# EAGLE design CC2530_PCB_Updated_Antenna+Stim+EMG-ROACH (EAGLE 7.1.0)
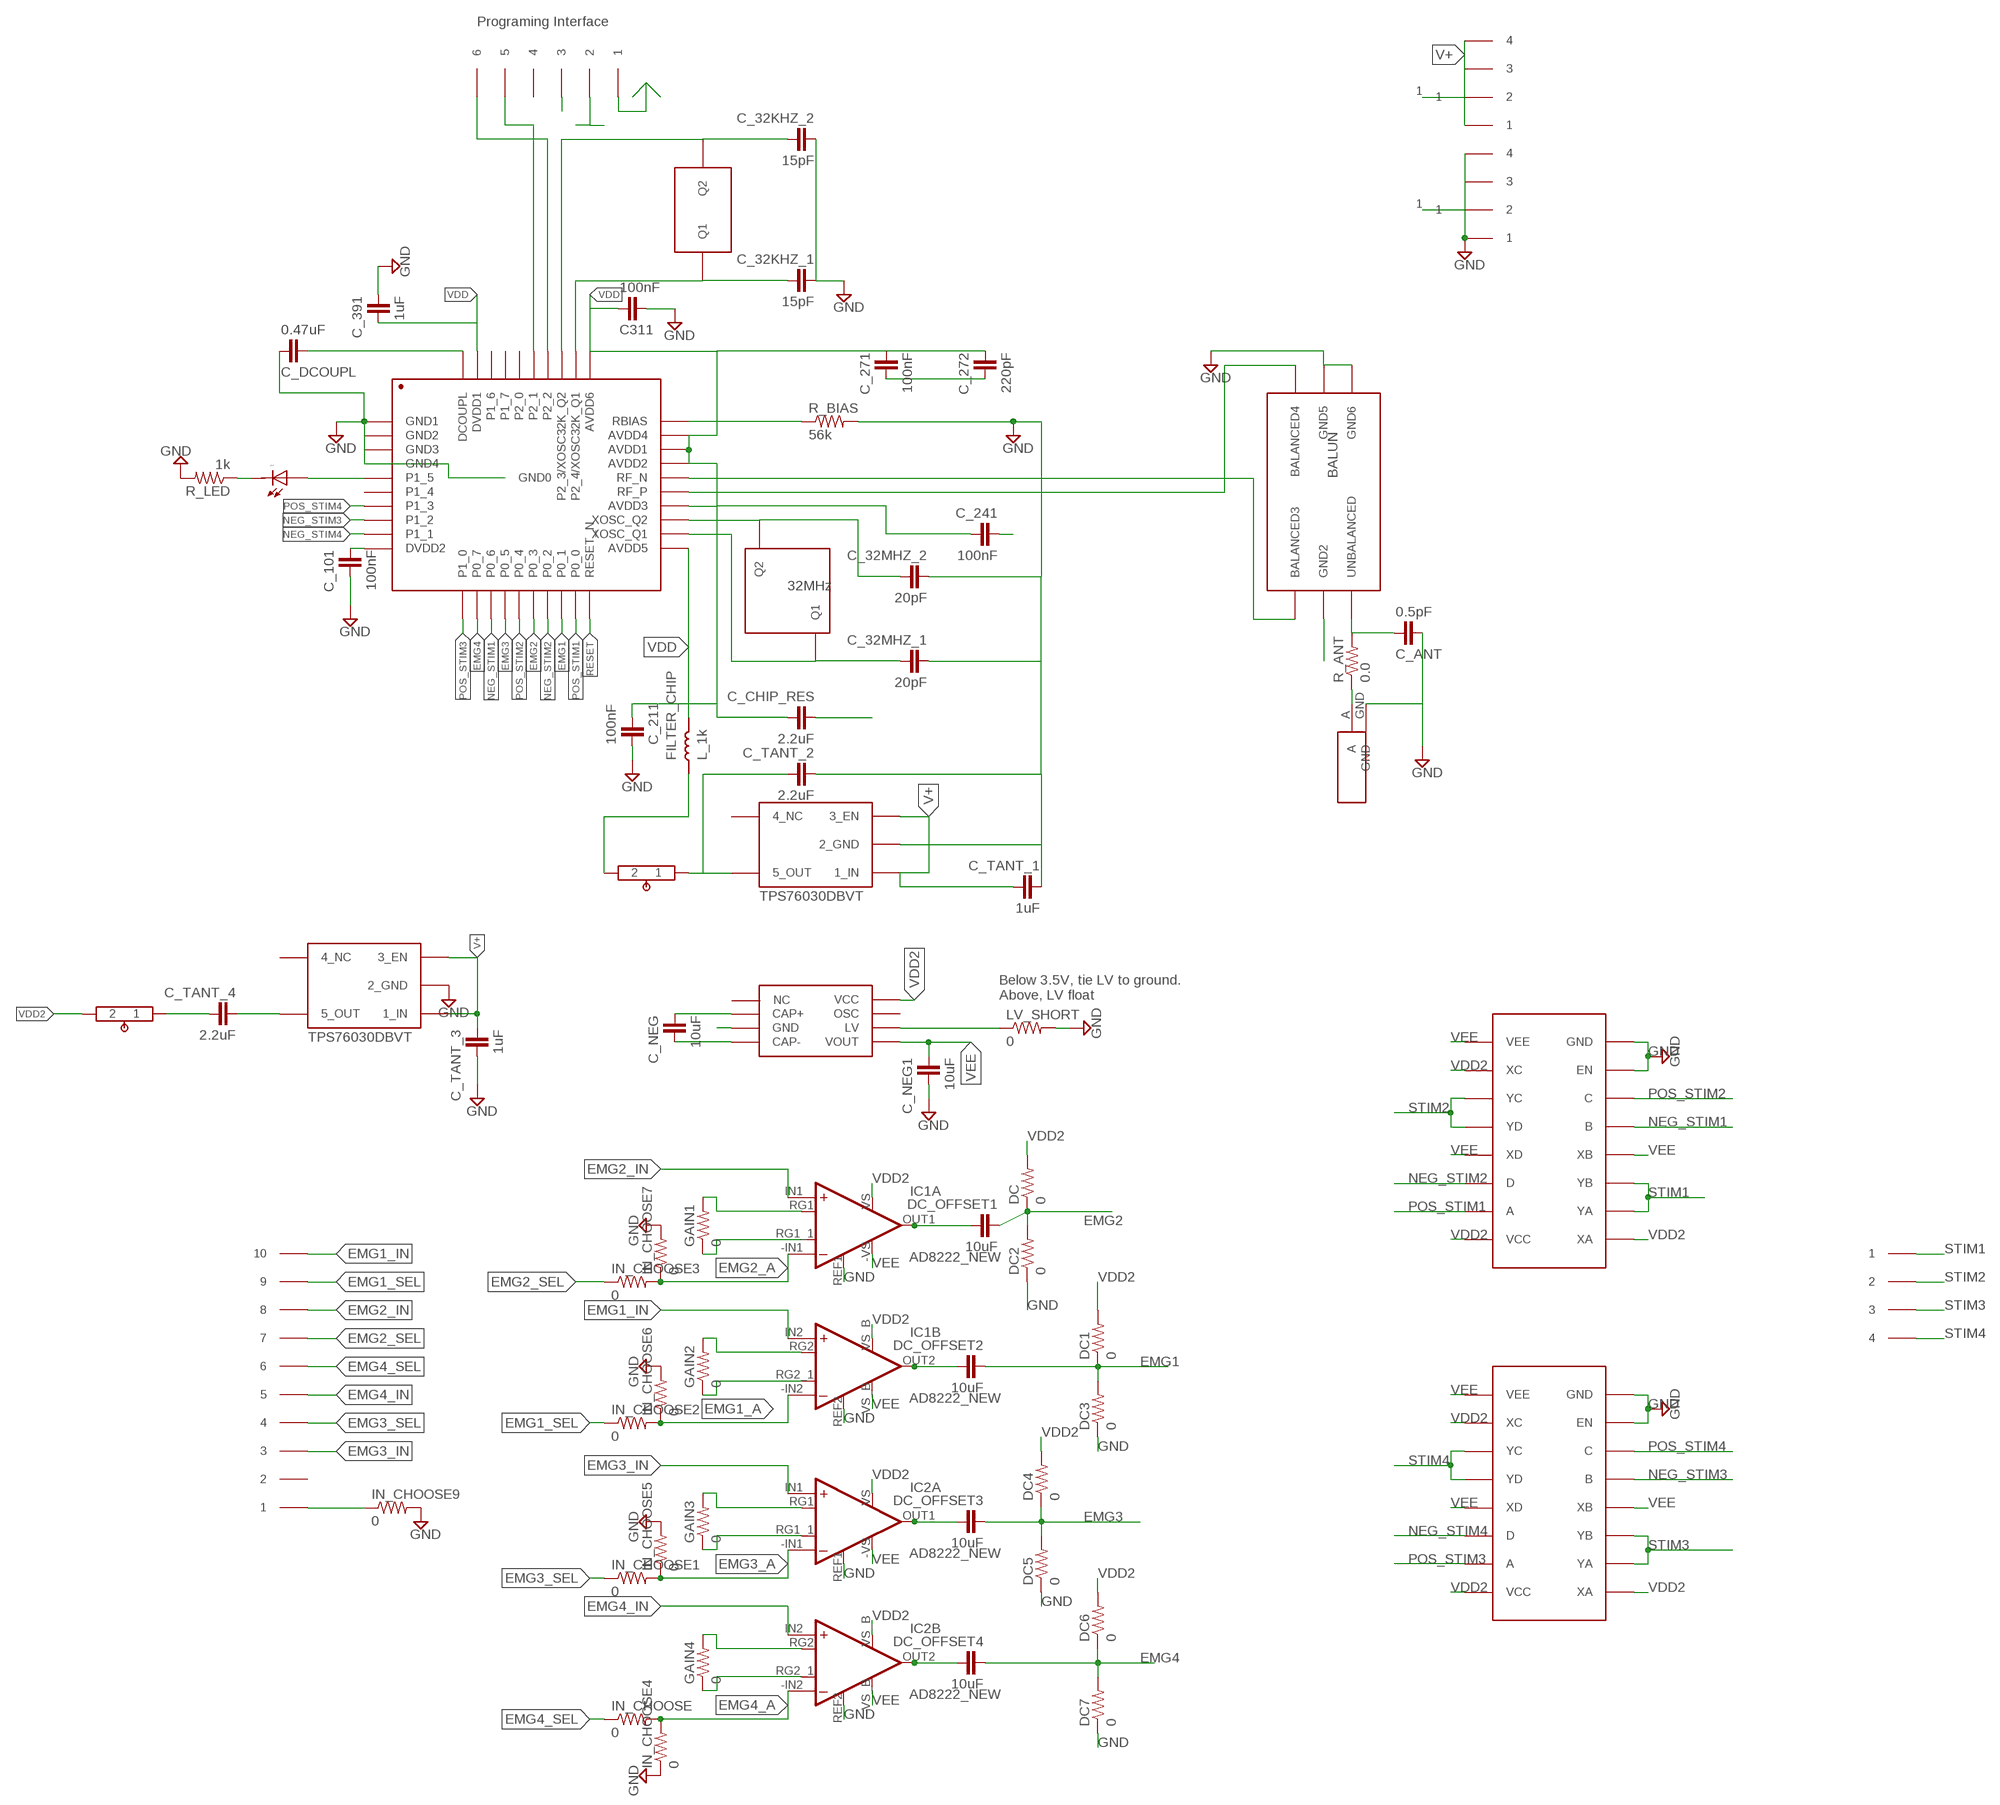
[diagram p0: schematic, sheet 1]

## Parts
32KHZ  X32.768KHZ  [X32.768KHZ]
C311  100nF  0Y0X_C0201  [0201_R/L/C]
C_32KHZ_1  15pF  0Y0X_C0201  [0201_R/L/C]
C_32KHZ_2  15pF  0Y0X_C0201  [0201_R/L/C]
C_32MHZ_1  20pF  0Y0X_C0201  [0201_R/L/C]
C_32MHZ_2  20pF  0Y0X_C0201  [0201_R/L/C]
C_101  100nF  0Y0X_C0201  [0201_R/L/C]
C_211  100nF  0Y0X_C0201  [0201_R/L/C]
C_241  100nF  0Y0X_C0201  [0201_R/L/C]
C_271  100nF  0Y0X_C0201  [0201_R/L/C]
C_272  220pF  0Y0X_C0201  [0201_R/L/C]
C_391  1uF  0Y0X_C0201  [0201_R/L/C]
C_ANT  0.5pF  0Y0X_C0201  [0201_R/L/C]
C_CHIP_RES  2.2uF  0Y0X_C0402  [0402_R/L/C]
C_DCOUPL  0.47uF  0Y0X_C0201  [0201_R/L/C]
C_NEG  10uF  0Y0X_C0402  [0402_R/L/C]
C_NEG1  10uF  0Y0X_C0402  [0402_R/L/C]
C_TANT_1  1uF  0Y0X_C0603  [0603_R/L/C]
C_TANT_2  2.2uF  0Y0X_C0603  [0603_R/L/C]
C_TANT_3  1uF  0Y0X_C0603  [0603_R/L/C]
C_TANT_4  2.2uF  0Y0X_C0603  [0603_R/L/C]
DC  0  0Y0X_R0402  [0402_R/L/C]
DC1  0  0Y0X_R0402  [0402_R/L/C]
DC2  0  0Y0X_R0402  [0402_R/L/C]
DC3  0  0Y0X_R0402  [0402_R/L/C]
DC4  0  0Y0X_R0402  [0402_R/L/C]
DC5  0  0Y0X_R0402  [0402_R/L/C]
DC6  0  0Y0X_R0402  [0402_R/L/C]
DC7  0  0Y0X_R0402  [0402_R/L/C]
DC_OFFSET1  10uF  0Y0X_C0402  [0402_R/L/C]
DC_OFFSET2  10uF  0Y0X_C0402  [0402_R/L/C]
DC_OFFSET3  10uF  0Y0X_C0402  [0402_R/L/C]
DC_OFFSET4  10uF  0Y0X_C0402  [0402_R/L/C]
FILTER_CHIP  L_1k  0Y0X_L0402  [0402_R/L/C]
GAIN1  0  0Y0X_R0402  [0402_R/L/C]
GAIN2  0  0Y0X_R0402  [0402_R/L/C]
GAIN3  0  0Y0X_R0402  [0402_R/L/C]
GAIN4  0  0Y0X_R0402  [0402_R/L/C]
GND_IN  FFC4POS  [FFC4POS]
IC1  AD8222_NEW  [QFN-16]
IC2  AD8222_NEW  [QFN-16]
IN_CHOOSE  0  0Y0X_R0201  [0201_R/L/C]
IN_CHOOSE1  0  0Y0X_R0201  [0201_R/L/C]
IN_CHOOSE2  0  0Y0X_R0201  [0201_R/L/C]
IN_CHOOSE3  0  0Y0X_R0201  [0201_R/L/C]
IN_CHOOSE4  0  0Y0X_R0201  [0201_R/L/C]
IN_CHOOSE5  0  0Y0X_R0201  [0201_R/L/C]
IN_CHOOSE6  0  0Y0X_R0201  [0201_R/L/C]
IN_CHOOSE7  0  0Y0X_R0201  [0201_R/L/C]
IN_CHOOSE9  0  0Y0X_R0201  [0201_R/L/C]
INVERTED_F-ANTENNA  ANTENNA  [ANTENNA]
LED  LED0603  [0603_R/L/C]
LV_SHORT  0  0Y0X_R0402  [0402_R/L/C]
R_ANT  0.0  0Y0X_R0201  [0201_R/L/C]
R_BIAS  56k  0Y0X_R0201  [0201_R/L/C]
R_LED  1k  0Y0X_R0402  [0402_R/L/C]
U$1  CC2530  [CC2530]
U$2  BALUN  [BALUN]
U$3  X32MHZ  [X32MHZ]
U$4  TL7660  [S-PDSO-G8]
U$5  MC74HC4316A  [SOIC-16-ON-SEMI]
U$6  MC74HC4316A  [SOIC-16-ON-SEMI]
U$7  FFC10POS  [FFC10POS]
U$8  REGULATOR  [REGULATOR]
U$9  SWITCH_MANUAL  [SWITCH_MANUAL]
U$10  REGULATOR  [REGULATOR]
U$17  FFC6POS  [FFC6POS]
U$18  SWITCH_MANUAL  [SWITCH_MANUAL]
U$28  FFC4POS  [FFC4POS]
V+_IN  FFC4POS  [FFC4POS]
WIRE+  DRILL_CONNECT  [DRILL_CONNECT]
WIRE-  DRILL_CONNECT  [DRILL_CONNECT]

## Nets
DCOUPL1: C_DCOUPL.1 U$1.DCOUPL
EMG1: DC1.1 DC3.2 DC_OFFSET2.2 U$1.P0_1
EMG1_A: IC1.-IN2(B:-IN) IN_CHOOSE2.2 IN_CHOOSE6.1
EMG1_IN: IC1.IN2(B:+IN) U$7.10
EMG1_SEL: IN_CHOOSE2.1 U$7.9
EMG2: DC2.2 DC.1 DC_OFFSET1.2 U$1.P0_3
EMG2_A: IC1.-IN1(A:-IN) IN_CHOOSE3.2 IN_CHOOSE7.1
EMG2_IN: IC1.IN1(A:+IN) U$7.8
EMG2_SEL: IN_CHOOSE3.1 U$7.7
EMG3: DC4.1 DC5.2 DC_OFFSET3.2 U$1.P0_5
EMG3_A: IC2.-IN1(A:-IN) IN_CHOOSE1.2 IN_CHOOSE5.1
EMG3_IN: IC2.IN1(A:+IN) U$7.3
EMG3_SEL: IN_CHOOSE1.1 U$7.4
EMG4: DC6.1 DC7.2 DC_OFFSET4.2 U$1.P0_7
EMG4_A: IC2.-IN2(B:-IN) IN_CHOOSE4.2 IN_CHOOSE.2
EMG4_IN: IC2.IN2(B:+IN) U$7.5
EMG4_SEL: IN_CHOOSE.1 U$7.6
GND: C311.1 C_32KHZ_1.2 C_32KHZ_2.2 C_32MHZ_1.2 C_32MHZ_2.2 C_101.1 C_211.2 C_241.2 C_271.1 C_272.1 C_391.2 C_ANT.1 C_CHIP_RES.2 C_DCOUPL.2 C_NEG1.1 C_TANT_1.2 C_TANT_2.2 C_TANT_3.1 DC2.1 DC3.1 DC5.1 DC7.1 GND_IN.1 GND_IN.2 GND_IN.3 GND_IN.4 IC1.REF1(A:REF) IC1.REF2(B:REF) IC2.REF1(A:REF) IC2.REF2(B:REF) IN_CHOOSE4.1 IN_CHOOSE5.2 IN_CHOOSE6.2 IN_CHOOSE7.2 IN_CHOOSE9.2 INVERTED_F-ANTENNA.GND LV_SHORT.2 R_BIAS.2 R_LED.2 U$1.GND0 U$1.GND1 U$1.GND001(GND0) U$1.GND2 U$1.GND002(GND0) U$1.GND3 U$1.GND003(GND0) U$1.GND4 U$1.GND004(GND0) U$1.GND005(GND0) U$1.GND006(GND0) U$1.GND007(GND0) U$1.GND008(GND0) U$1.GND009(GND0) U$1.GND010(GND0) U$1.GND011(GND0) U$1.GND012(GND0) U$1.GND013(GND0) U$1.GND014(GND0) U$1.GND015(GND0) U$1.GND016(GND0) U$2.GND2 U$2.GND5 U$2.GND6 U$4.3(GND) U$5.7(EN) U$5.8(GND) U$6.7(EN) U$6.8(GND) U$8.2(2_GND) U$10.2(2_GND) U$17.2 WIRE-.1
LED/P1_5: LED.1(A) U$1.P1_5
N$1: C_ANT.2 R_ANT.2 U$2.UNBALANCED
N$2: INVERTED_F-ANTENNA.A R_ANT.1
N$3: C_NEG.2 U$4.2(CAP+)
N$4: C_NEG.1 U$4.4(CAP-)
N$5: LV_SHORT.1 U$4.6(LV)
N$6: GAIN1.2 IC1.RG1(A:RG1)
N$7: GAIN1.1 IC1.RG1_1(A:RG1_1)
N$8: GAIN2.2 IC1.RG2(B:RG1)
N$9: GAIN2.1 IC1.RG2_1(B:RG1_1)
N$10: GAIN3.2 IC2.RG1(A:RG1)
N$11: GAIN3.1 IC2.RG1_1(A:RG1_1)
N$12: GAIN4.2 IC2.RG2(B:RG1)
N$13: GAIN4.1 IC2.RG2_1(B:RG1_1)
N$14: DC_OFFSET1.1 IC1.OUT1(A:OUT)
N$15: DC_OFFSET2.1 IC1.OUT2(B:OUT)
N$16: DC_OFFSET4.1 IC2.OUT2(B:OUT)
N$17: DC_OFFSET3.1 IC2.OUT1(A:OUT)
N$18: C_TANT_4.2 U$8.5(5_OUT)
N$19: C_TANT_4.1 U$9.1
N$21: C_TANT_2.1 U$10.5(5_OUT) U$18.1
N$28: IN_CHOOSE9.1 U$7.1
N$34: LED.2(C) R_LED.1
NEG_STIM1: U$1.P0_6 U$5.5(B)
NEG_STIM2: U$1.P0_2 U$5.14(D)
NEG_STIM3: U$1.P1_2 U$6.5(B)
NEG_STIM4: U$1.P1_1 U$6.14(D)
P2_1: U$1.P2_1 U$17.5
P2_2: U$1.P2_2 U$17.6
P2_3/X32K_Q2: 32KHZ.Q2 C_32KHZ_2.1 U$1.P2_3/XOSC32K_Q2
P2_4/X32K_Q1: 32KHZ.Q1 C_32KHZ_1.1 U$1.P2_4/XOSC32K_Q1
POS_STIM1: U$1.P0_0 U$5.15(A)
POS_STIM2: U$1.P0_4 U$5.6(C)
POS_STIM3: U$1.P1_0 U$6.15(A)
POS_STIM4: U$1.P1_3 U$6.6(C)
RBIAS: R_BIAS.1 U$1.RBIAS
RESET: U$1.RESET_N U$17.3
RF_N: U$1.RF_N U$2.BALANCED3
RF_P: U$1.RF_P U$2.BALANCED4
STIM1: U$5.2(YA) U$5.3(YB) U$28.1
STIM2: U$5.11(YC) U$5.12(YD) U$28.2
STIM3: U$6.2(YA) U$6.3(YB) U$28.3
STIM4: U$6.11(YC) U$6.12(YD) U$28.4
SWITCH_OUT: FILTER_CHIP.1 U$18.2
V+: C_TANT_1.1 C_TANT_3.2 U$8.1(1_IN) U$8.3(3_EN) U$10.1(1_IN) U$10.3(3_EN) V+_IN.1 V+_IN.2 V+_IN.3 V+_IN.4 WIRE+.1
VDD: C311.2 C_101.2 C_211.1 C_241.1 C_271.2 C_272.2 C_391.1 C_CHIP_RES.1 FILTER_CHIP.2 U$1.AVDD1 U$1.AVDD2 U$1.AVDD3 U$1.AVDD4 U$1.AVDD5 U$1.AVDD6 U$1.DVDD1 U$1.DVDD2 U$17.1
VDD2: DC1.2 DC4.2 DC6.2 DC.2 IC1.VS(A:V+) IC1.VS_B(B:V+) IC2.VS(A:V+) IC2.VS_B(B:V+) U$4.8(VCC) U$5.1(XA) U$5.10(XC) U$5.16(VCC) U$6.1(XA) U$6.10(XC) U$6.16(VCC) U$9.2
VEE: C_NEG1.2 IC1.-VS(A:V-) IC1.-VS_B(B:V-) IC2.-VS(A:V-) IC2.-VS_B(B:V-) U$4.5(VOUT) U$5.4(XB) U$5.9(VEE) U$5.13(XD) U$6.4(XB) U$6.9(VEE) U$6.13(XD)
X32M_Q1: C_32MHZ_1.1 U$1.XOSC_Q1 U$3.Q1
X32M_Q2: C_32MHZ_2.1 U$1.XOSC_Q2 U$3.Q2
Unconnected: U$1.P1_4 U$1.P1_6 U$1.P1_7 U$1.P2_0 U$7.2 U$8.4(4_NC) U$10.4(4_NC) U$17.4

## Notes on the sheet
- Programing Interface
- Below 3.5V, tie LV to ground. 
  Above, LV float

## Power pins joined to a net without a drawn wire
NC: U$4.1(NC)
OSC: U$4.7(OSC)

## Library data of the parts
32KHZ = CC2530_PCB_TL:X32.768KHZ: X32.768kHz 9HT11-32.768KDZC-T
C311 C_32KHZ_1 C_32KHZ_2 C_32MHZ_1 C_32MHZ_2 C_101 C_211 C_241 C_271 C_272 C_391 C_ANT C_CHIP_RES C_DCOUPL C_NEG C_NEG1 C_TANT_1-C_TANT_4 DC_OFFSET1-DC_OFFSET4 = CC2530_PCB_TL:0Y0X_C
DC DC1-DC7 GAIN1-GAIN4 IN_CHOOSE IN_CHOOSE1-IN_CHOOSE7 IN_CHOOSE9 LV_SHORT R_ANT R_BIAS R_LED = CC2530_PCB_TL:0Y0X_R: Package / Case 0201 (0603 Metric)
FILTER_CHIP = CC2530_PCB_TL:0Y0X_L
GND_IN U$28 V+_IN = CC2530_PCB_TL:FFC4POS: FFC COnnector 4POS
IC1 IC2 = moth:AD8222_NEW: OP AMP AD8222 Dual package instrumentation amplifier
INVERTED_F-ANTENNA = CC2530_PCB_TL:ANTENNA: Antenna
LED = CC2530_PCB_TL:LED
U$1 = CC2530_PCB_TL:CC2530: CC2530_QFN40
U$2 = CC2530_PCB_TL:BALUN: 2.45 GHz Impedance Matched Balun-BPF: For TI CC253X, CC254X, CC257X, CC853X and CC852X Chipset family P/N 2450BM15A0002
U$3 = CC2530_PCB_TL:X32MHZ: X32MHz ABM12-32.000MHZ-B2X-T3; X: 32MHz
U$4 = moth:TL7660
U$5 U$6 = moth:MC74HC4316A
U$7 = CC2530_PCB_TL:FFC10POS: FFC Connector 10POS
U$8 U$10 = CC2530_PCB_TL:REGULATOR: IC REG LDO 3V 50MA SOT23-5 TPS76030DBVT
U$9 U$18 = CC2530_PCB_TL:SWITCH_MANUAL
U$17 = CC2530_PCB_TL:FFC6POS: FFC Connector 6POS
WIRE+ WIRE- = CC2530_PCB_TL:DRILL_CONNECT

## Board
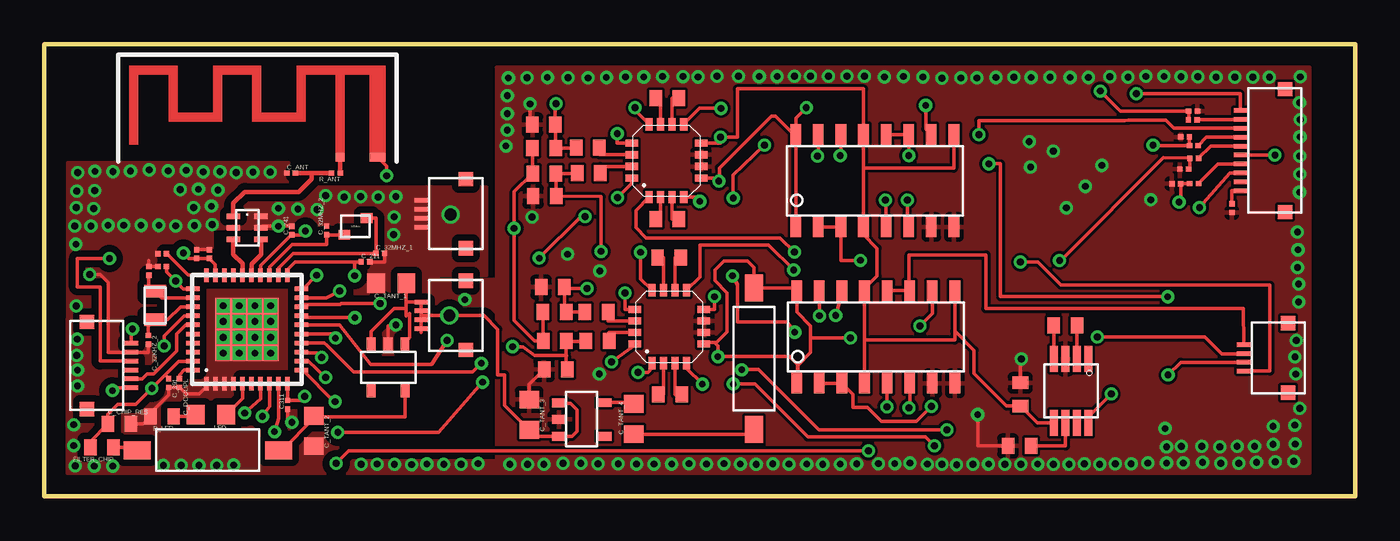
[diagram p1: board, top side]
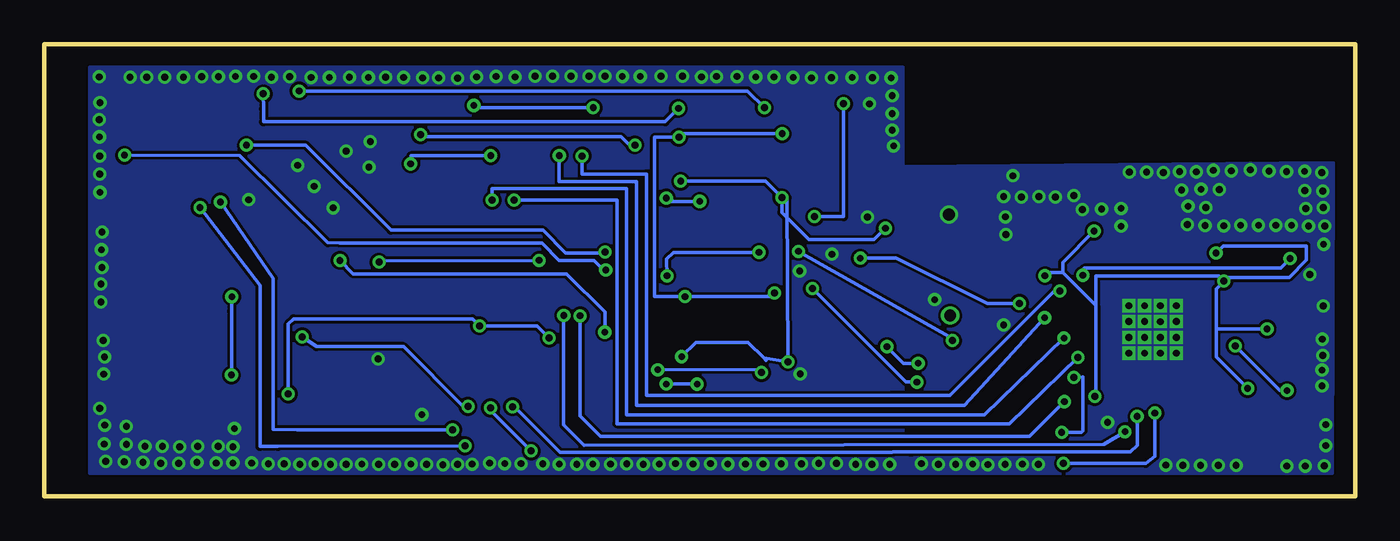
[diagram p2: board, bottom side, seen from below]

Size 73.66 x 25.4 mm. Coordinates in mm from the lower left corner, seen from the top.
Outline: 0,0 0,25.4 73.66,25.4 73.66,0 0,0
Copper layers (1*16): Top 0.0356mm / dielectric 1.5011mm / Bottom 0.0356mm
Design rules "Eagle_DRC_OSHPark": minimum track width 6mil, minimum drill 13mil, track to track 6mil, track to pad 6mil, pad to pad 6mil, via to via 6mil, smd to smd 6mil, copper to edge 15mil, drill to drill 6mil, minimum pad ring 7mil, minimum via ring 7mil, stop-mask expansion 3mil, vias tented up to drill 0mil, thermal gap 10mil

### Footprints (pad centres in the part's own frame; a part is rotated, then mirrored left to right if it is on the bottom)
X32.768KHZ = smd 1.25 x 0.7: Q1 0.009,-0.811; Q2 0.009,0.789
0201_R/L/C = smd 0.3 x 0.3: 1 -0.245,-0.001; 2 0.245,-0.001
0402_R/L/C = smd 0.7 x 0.9: 1 -0.65,0.001; 2 0.65,0.001
0603_R/L/C = smd 1 x 1.1: 1 -0.85,0; 2 0.85,0
FFC4POS = smd 0.762 x 0.254: 1 0.04,0.742; 2 0.04,0.242; 3 0.04,-0.258; 4 0.04,-0.758 | smd 0.8 x 0.8: P$5 -2.46,1.94; P$6 -2.46,-1.96
QFN-16 = smd 0.7 x 0.4: -IN1 -2.05,0.975; -IN2 2.05,0.975; IN1 -2.05,-0.975; IN2 2.05,-0.975; RG1 -2.05,0.325; RG1_1 -2.05,-0.325; RG2 2.05,0.325; RG2_1 2.05,-0.325 | smd 0.4 x 0.7: -VS 0.975,1.95; -VS_B 0.975,-1.95; OUT1 -0.325,1.95; OUT2 0.325,1.95; REF1 -0.325,-1.95; REF2 0.325,-1.95; VS -0.975,1.95; VS_B -0.975,-1.95
ANTENNA = smd 0.5 x 0.5: A 0,0 | smd 0.5 x 0.9: GND 0,-2.1
CC2530 = smd 0.762 x 0.254: AVDD1 3.048,1.27; AVDD2 3.048,0.762; AVDD3 3.048,-0.762; AVDD4 3.048,1.778; AVDD5 3.048,-2.286; DVDD2 -3.048,-2.286; GND1 -3.048,2.286; GND2 -3.048,1.778; GND3 -3.048,1.27; GND4 -3.048,0.762; P1_1 -3.048,-1.778; P1_2 -3.048,-1.27; P1_3 -3.048,-0.762; P1_4 -3.048,-0.254; P1_5 -3.048,0.254; RBIAS 3.048,2.286; RF_N 3.048,0.254; RF_P 3.048,-0.254; XOSC_Q1 3.048,-1.778; XOSC_Q2 3.048,-1.27 | smd 0.254 x 0.762: AVDD6 2.286,3.048; DCOUPL -2.286,3.048; DVDD1 -1.778,3.048; P0_0 1.778,-3.048; P0_1 1.27,-3.048; P0_2 0.762,-3.048; P0_3 0.254,-3.048; P0_4 -0.254,-3.048; P0_5 -0.762,-3.048; P0_6 -1.27,-3.048; P0_7 -1.778,-3.048; P1_0 -2.286,-3.048; P1_6 -1.27,3.048; P1_7 -0.762,3.048; P2_0 -0.254,3.048; P2_1 0.254,3.048; P2_2 0.762,3.048; P2_3/XOSC32K_Q2 1.27,3.048; P2_4/XOSC32K_Q1 1.778,3.048; RESET_N 2.286,-3.048 | smd 3.56 x 3.56: GND0 0,0 | drill 0.381 square: GND001 -1.335,1.335; GND002 -0.445,1.335; GND003 0.445,1.335; GND004 1.335,1.335; GND005 -1.335,0.445; GND006 -0.445,0.445; GND007 0.44,0.445; GND008 1.335,0.445; GND009 -1.335,-0.445; GND010 -0.445,-0.445; GND011 0.445,-0.445; GND012 1.335,-0.445; GND013 -1.335,-1.335; GND014 -0.445,-1.335; GND015 0.445,-1.335; GND016 1.335,-1.335
BALUN = smd 0.75 x 0.3: BALANCED3 -0.782,-0.655; BALANCED4 0.768,-0.655; GND2 -0.782,-0.005; GND5 0.768,-0.005; GND6 0.768,0.645; UNBALANCED -0.782,0.645
X32MHZ = smd 0.55 x 0.65: Q1 0.496,-0.576; Q2 -0.454,0.674
S-PDSO-G8 = smd 0.45 x 1.45: 1 -0.975,-1.8; 2 -0.325,-1.8; 3 0.325,-1.8; 4 0.975,-1.8; 5 0.975,1.8; 6 0.325,1.8; 7 -0.325,1.8; 8 -0.975,1.8
SOIC-16-ON-SEMI = smd 0.6 x 1.15: 1 -4.445,-2.6; 2 -3.175,-2.6; 3 -1.905,-2.6; 4 -0.635,-2.6; 5 0.635,-2.6; 6 1.905,-2.6; 7 3.175,-2.6; 8 4.445,-2.6; 9 4.445,2.6; 10 3.175,2.6; 11 1.905,2.6; 12 0.635,2.6; 13 -0.635,2.6; 14 -1.905,2.6; 15 -3.175,2.6; 16 -4.445,2.6
FFC10POS = smd 0.762 x 0.254: 1 -0.015,2.271; 2 -0.015,1.771; 3 -0.015,1.271; 4 -0.015,0.771; 5 -0.015,0.271; 6 -0.015,-0.229; 7 -0.015,-0.729; 8 -0.015,-1.229; 9 -0.015,-1.729; 10 -0.015,-2.229 | smd 0.8 x 0.8: P$11 -2.52,3.47; P$12 -2.52,-3.43
REGULATOR = smd 0.5 x 0.8: 1 0.94,1.275; 2 0,1.275; 3 -0.95,1.275; 4 -0.95,-1.275; 5 0.95,-1.275
SWITCH_MANUAL = smd 1.524 x 1.016: 1 -4.13,0; 2 3.81,0
FFC6POS = smd 0.762 x 0.254: 1 0.008,1.269; 2 0.008,0.769; 3 0.008,0.269; 4 0.008,-0.231; 5 0.008,-0.731; 6 0.008,-1.231 | smd 0.8 x 0.8: P$7 -2.49,2.47; P$8 -2.49,-2.43
DRILL_CONNECT = drill 0.66 pad 1.016: 1 0,0

### Placement (x,y rotation side)
32KHZ  6.23,10.71 180 top
C311  13.67,5.14 90 top
C_32KHZ_1  5.86,12.67 90 top
C_32KHZ_2  5.84,8.79 270 top
C_32MHZ_1  18.87,13.65 0 top
C_32MHZ_2  15.85,14.94 90 top
C_101  6.62,12.91 0 top
C_211  18.04,13.17 0 top
C_241  13.9,14.93 90 top
C_271  9.27,13.62 270 top
C_272  8.56,13.62 270 top
C_391  6.98,6.35 270 top
C_ANT  13.86,18.16 0 top
C_CHIP_RES  4.21,4.06 0 top
C_DCOUPL  7.6,6.35 270 top
C_NEG  57.38,9.58 0 top
C_NEG1  54.84,5.72 270 top
C_TANT_1  19.49,11.98 180 top
C_TANT_2  15.14,3.66 270 top
C_TANT_3  27.25,4.58 270 top
C_TANT_4  33.13,4.34 90 top
DC  28.08,18.15 180 top
DC1  28.08,19.56 180 top
DC2  28.11,16.86 0 top
DC3  28.07,20.89 0 top
DC4  28.67,8.71 180 top
DC5  28.74,7.12 0 top
DC6  28.67,10.35 180 top
DC7  28.57,11.75 0 top
DC_OFFSET1  30.59,18.16 180 top
DC_OFFSET2  30.54,19.6 180 top
DC_OFFSET3  31.08,8.74 180 top
DC_OFFSET4  31.03,10.35 180 top
FILTER_CHIP  3.24,2.75 180 top
GAIN1  35.01,15.59 180 top
GAIN2  35.01,22.39 180 top
GAIN3  35.16,5.71 180 top
GAIN4  35.11,13.41 180 top
GND_IN  21.22,15.87 180 top
IC1  34.96,18.87 90 top
IC2  35.12,9.53 90 top
IN_CHOOSE  64.62,19 180 top
IN_CHOOSE1  64.62,17.58 180 top
IN_CHOOSE2  64.54,21.16 180 top
IN_CHOOSE3  64.6,19.71 180 top
IN_CHOOSE4  64.06,18.39 0 top
IN_CHOOSE5  63.61,17.57 180 top
IN_CHOOSE6  64.56,21.65 0 top
IN_CHOOSE7  64.1,20.2 180 top
IN_CHOOSE9  66.74,16.19 270 top
INVERTED_F-ANTENNA  16.62,19.05 90 top
LED  9.35,4.57 180 top
LV_SHORT  54.81,2.83 180 top
R_ANT  16.38,18.16 180 top
R_BIAS  6.62,13.64 180 top
R_LED  6.61,4.49 180 top
U$1  11.38,9.37 90 top
U$2  11.4,15.09 0 top
U$3  17.53,15.15 90 top
U$4  57.71,5.92 180 top
U$5  46.67,17.74 0 top
U$6  46.73,8.95 0 top
U$7  67.2,19.45 180 top
U$8  30.19,4.31 90 top
U$9  39.87,7.88 90 top
U$10  19.31,7.24 0 top
U$17  4.87,7.33 0 top
U$18  9.02,2.59 180 top
U$28  67.44,7.76 180 top
V+_IN  21.22,10.16 180 top
WIRE+  22.75,10.16 90 top
WIRE-  22.83,15.84 90 top

### Tracks (layer width: path | path; a pad name or v marks a point on that pad's centre or on a via)
DCOUPL1
  Top 0.203: U$1.DCOUPL 7.86,7.09 7.59,6.82 C_DCOUPL.1
EMG1  (via drill 0.38)
  Top 0.203: 18.75,10.65 v18.86,10.84 16.68,10.84 16.62,10.77 14.55,10.77 U$1.P0_1 | DC_OFFSET2.2 29.84,19.56 DC1.1 DC3.2 28.7,20.91 28.7,22.07 v28.75,22.07 | v30.38,15.72 30.15,15.72 v27.81,13.38
  Bottom 0.203: v18.86,10.84 20.68,10.83 25.79,13.38 v27.81,13.38 | v28.75,22.07 28.75,15.72 v30.38,15.72
EMG1_A  (via drill 0.38)
  Top 0.203: IN_CHOOSE2.2 64.31,21.18 IN_CHOOSE6.1 60.48,21.65 v59.35,22.78 | IC1.-IN2 33.2,21.7 v33.2,21.84
  Bottom 0.203: v33.2,21.84 34.14,22.78 v59.35,22.78
EMG1_IN  (via drill 0.38)
  Top 0.203: IC1.IN2 36.82,21.81 v38.03,21.81 | U$7.10 67.2,22.63 v61.36,22.63
  Bottom 0.203: v38.03,21.81 38.78,21.05 61.34,21.05 61.34,21.77 v61.36,22.63
EMG1_SEL
  Top 0.203: U$7.9 67.2,21.16 IN_CHOOSE2.1
EMG2  (via drill 0.38)
  Top 0.203: U$1.P0_3 16.58,9.63 18.34,7.41 21.75,7.41 v22.63,8.75 | v31.28,13.76 31.28,16.84 DC2.2 28.76,18.12 DC.1 29.93,18.15 DC_OFFSET1.2
  Bottom 0.203: v22.63,8.75 22.63,8.85 v31.28,13.76
EMG2_A  (via drill 0.38)
  Top 0.203: IC1.-IN1 33.24,16.07 33.24,15.11 33.82,14.52 41.35,14.52 v42.15,13.72 | IN_CHOOSE7.1 64.36,20.28 IN_CHOOSE3.2 62.33,19.71 v62.31,19.74
  Bottom 0.203: v42.15,13.72 42.19,13.68 44.37,13.68 45.64,14.96 54.19,14.96 58.97,19.74 v62.31,19.74
EMG2_IN  (via drill 0.38)
  Top 0.203: U$7.8 63.48,20.69 63.02,21.14 60.91,21.14 60.74,21.12 52.52,21.13 v52.52,20.32 | v40.47,19.74 38.71,18.06 v38.71,16.76 | v36.83,16.58 36.59,16.82 IC1.IN1
  Bottom 0.203: v52.52,20.32 52.41,20.22 41.26,20.22 40.78,19.74 v40.47,19.74 | v38.71,16.76 38.58,16.58 v36.83,16.58
EMG2_SEL
  Top 0.203: IN_CHOOSE3.1 65.31,20.18 U$7.7
EMG3  (via drill 0.38)
  Top 0.203: DC_OFFSET3.2 30.43,8.69 29.43,8.69 29.43,8.71 DC4.1 29.32,7.74 | DC5.2 29.32,7.12 29.32,7.74 | U$1.P0_5 15.73,8.61 15.88,8.46 17.36,6.98 24.06,6.98 v24.55,7.47 | v26.31,8.4 26.89,8.4 27.56,7.91 29.33,7.91 29.32,7.74
  Bottom 0.203: v24.55,7.47 25.38,7.47 v26.31,8.4
EMG3_A  (via drill 0.38)
  Top 0.203: IN_CHOOSE1.2 IN_CHOOSE5.1 63.88,16.54 v63.77,16.54 | IC2.-IN1 34.14,7.2 33.91,6.97 v33.36,6.96 | v50.72,3.73 43.52,3.73 40.12,7.13 39.22,7.13 v39.19,7.11
  Bottom 0.203: v33.36,6.96 33.55,7.12 v39.19,7.11 | v50.72,3.73 59.46,3.73 60.8,3.75 60.8,12.24 v63.77,16.54
EMG3_IN  (via drill 0.38)
  Top 0.203: IC2.IN1 36.09,7.18 v36.98,6.3 | v64.92,16.23 66.63,18.18 U$7.3 | v38.71,6.3 39.93,6.3 42.91,3.32 49.53,3.32 v50.02,2.83
  Bottom 0.203: v36.98,6.3 38.96,6.3 v38.71,6.3 | v50.02,2.83 60.55,2.79 61.54,2.79 61.54,11.85 v64.92,16.23
EMG3_SEL
  Top 0.203: IN_CHOOSE1.1 65.96,18.68 U$7.4
EMG4  (via drill 0.38)
  Top 0.203: DC_OFFSET4.2 DC6.1 29.22,10.35 DC7.2 29.3,11.67 v30.5,11.67 | U$1.P0_7 14.83,7.59 v15.8,6.68 | v16.49,3.59 22.15,3.59 v24.63,6.41
  Bottom 0.203: v15.8,6.68 15.29,6.7 15.29,3.67 15.38,3.59 v16.49,3.59 | v24.63,6.41 25.25,6.42 v30.5,11.67
EMG4_A  (via drill 0.38)
  Top 0.203: IN_CHOOSE4.2 64.37,18.38 IN_CHOOSE.2 62.89,19.02 57.14,13.28 v57.05,13.25 | v42.17,9.22 41.76,9.79 38.94,9.79 38.94,11.89 v38.68,12.39 | IC2.-IN2 33.5,12.22 v33.5,13.71
  Bottom 0.203: v33.5,13.71 38.3,13.71 38.69,13.33 v38.68,12.39 | v57.05,13.25 56.3,12.5 44.33,12.5 42.17,10.34 v42.17,9.22
EMG4_IN  (via drill 0.38)
  Top 0.203: v69.16,19.17 v69.16,19.18 U$7.5 | v42.11,12.71 40.7,14.13 36.84,14.13 36.84,12.34 IC2.IN2
  Bottom 0.203: v42.11,12.71 42.2,12.8 42.33,12.8 42.78,13.26 44.72,13.26 45.71,14.24 57.08,14.24 57.74,14.26 62.7,19.16 v69.16,19.17
EMG4_SEL
  Top 0.203: U$7.6 65.54,19.68 IN_CHOOSE.1
GND  (via drill 0.38, 0.38 pad 0.64)
  Top 0.203: U$1.GND4 U$1.GND3 U$1.GND2 U$1.GND1 9.1,6.14 8.71,5.75 7.95,5.75 C_DCOUPL.2 C_391.2 6.98,5.7 5.96,4.68 R_LED.2 5.54,4.06 C_CHIP_RES.2 | C_32KHZ_2.2 5.84,8.09 U$17.2 3.58,8.09 3.58,12.02 3.14,12.46 v2.54,12.46 | C_32KHZ_1.2 5.86,13.26 | C_32KHZ_1.2 | C_32KHZ_1.2 C_101.1 | C_272.1 C_271.1 | 12.14,8.04 U$1.GND009 U$1.GND005 U$1.GND001 U$1.GND002 U$1.GND006 U$1.GND010 U$1.GND011 U$1.GND007 U$1.GND003 U$1.GND004 U$1.GND008 U$1.GND012 U$1.GND016 U$1.GND015 U$1.GND014 U$1.GND013 | C_241.2 12.26,15.18 U$2.GND5 | INVERTED_F-ANTENNA.GND 19.23,18.55 v19.23,18.02 | C311.1 13.67,4.38 v13.9,4.14 | 18.62,11.98 C_TANT_1.2 | 18.62,13.17 C_211.2 19.12,13.17 C_32MHZ_1.2 | DC3.1 27.3,20.89 v27.3,22.06 | LV_SHORT.2 52.45,2.83 v52.45,4.58 | v54.91,7.71 54.84,7.71 C_NEG1.1 | U$10.2 19.31,9.56 v19.75,9.62 | C_TANT_3.1 27.25,6.28 DC5.1
  other vias: 1.81,17.15 7.96,18.32 3.85,18.24 4.83,18.28 1.86,18.2 9.86,18.24 6.96,18.29 12.68,18.23 6.68,1.73 7.68,1.73 9.68,1.72 8.68,1.72 13.15,15.18 13.15,16.18 14.24,16.14 15.33,16.11 8.92,18.23 2.83,18.27 19.62,14.71 10.64,1.75 23.63,11.05 29.4,13.6 31.21,12.67 1.73,1.71 2.79,1.69 3.84,1.69 1.64,2.84 1.64,4.02 1.84,8.83 5.88,18.35 1.79,16.23 2.82,17.18 7.63,17.24 9.75,17.21 8.43,15.22 3.57,15.23 8.65,17.26 9.38,16.3 10.77,18.19 9.42,15.27 2.61,15.19 11.71,18.23 1.82,7.92 1.86,7.09 26.07,23.52 27.12,23.54 29.43,23.54 28.27,23.55 30.55,23.52 67.12,1.84 66.11,1.85 70.23,1.96 62.99,3.8 27.41,15.7 50.44,23.5 31.18,6.87 69.18,1.93 70.43,12.86 68.12,1.9 7.37,15.2 6.43,15.23 5.43,15.23 4.46,15.23 8.38,16.23 1.7,15.19 2.77,16.17 19.64,15.7 19.75,16.84 18.76,16.82 17.77,16.84 16.84,16.82 15.81,16.91 70.3,2.93 70.27,3.99 65.09,1.9 64.01,1.86 63.07,1.86 62.02,1.86 62.18,16.67 63.07,2.77 63.9,2.8 65.05,2.8 66.06,2.76 67.04,2.8 68.01,2.8 69.06,2.91 69.06,3.92 70.49,11.92 70.46,13.86 70.49,10.91 70.28,7.83 70.59,21.17 70.57,20.2 70.55,19.13 70.55,18.12 55.42,18.5 55.35,19.93 57.43,16.22 58.51,17.42 59.44,18.6 56.7,19.41 31.58,23.55 32.66,23.57 33.68,23.57 34.73,23.6 35.89,23.6 36.74,23.57 26.02,22.51 26.02,21.51 26.02,20.58 37.8,23.62 39.01,23.62 40.18,23.6 41.18,23.6 42.16,23.62 43.06,23.62 44.06,23.62 45.1,23.62 46.08,23.62 47.21,23.58 48.28,23.6 49.38,23.58 51.51,23.52 52.41,23.52 53.47,23.54 54.49,23.56 55.45,23.54 56.52,23.56 57.65,23.54 58.67,23.54 59.88,23.58 60.9,23.56 61.9,23.61 62.92,23.61 63.88,23.58 64.82,23.58 65.85,23.56 66.91,23.56 67.91,23.56 68.85,23.56 70.59,23.58 70.54,22.12 70.54,17.08 70.42,14.86 70.56,4.93 61.08,1.82 60.18,1.82 40.94,1.81 41.85,1.8 42.84,1.8 43.74,1.79 44.73,1.8 45.65,1.81 46.88,1.82 47.79,1.82 48.65,1.86 49.62,1.8 50.45,1.79 51.26,1.76 52.19,1.78 53.06,1.8 53.98,1.79 54.88,1.79 55.83,1.8 56.71,1.79 57.59,1.79 58.44,1.82 59.31,1.79 40,1.79 39.11,1.8 38.2,1.82 37.21,1.8 36.23,1.83 35.25,1.8 34.26,1.8 33.27,1.8 32.25,1.82 31.12,1.82 30.15,1.84 29.14,1.84 28.07,1.79 27.15,1.78 26.16,1.78 24.38,1.83 23.41,1.78 22.44,1.78 21.49,1.8 20.63,1.77 19.67,1.78 18.69,1.8 17.8,1.78 1.79,10.69 1.77,14.17 1.86,6.2 70.32,6.86 70.36,8.75 25.93,19.69
  pour Top (isolate 0.381, no thermals): 13.67,17.37 13.73,18.77 1.3,18.77 1.27,1.27 25.4,1.27 25.4,12.19 9.42,12.32 9.42,15.04 11.92,15.06 13.64,15.06 13.64,12.42 24.85,12.42 24.85,17.37
  pour Bottom (no thermals): 1.23,18.77 1.27,1.27 25.4,1.27 25.4,18.54
  pour Bottom: 25.4,1.27 71.12,1.27 71.12,24.13 25.4,24.13
  pour Top: 71.12,1.27 71.12,24.13 25.4,24.13 25.4,1.27
LED/P1_5
  Top 0.203: U$1.P1_5 11.13,5.5 LED.1
N$1
  Top 0.203: C_ANT.2
  Top 0.254: U$2.UNBALANCED 10.62,16.47 11.25,17.1 14.29,17.1 15.01,17.83 15.01,18.16 | 15.01,18.16 R_ANT.2 | 15.01,18.16 C_ANT.2
N$2
  Top 0.203: INVERTED_F-ANTENNA.A
  Top 0.254: R_ANT.1 INVERTED_F-ANTENNA.A
N$3
  Top 0.203: C_NEG.2 U$4.2
N$4
  Top 0.203: C_NEG.1 U$4.4
N$5
  Top 0.203: U$4.6 57.38,2.83 LV_SHORT.1
N$6
  Top 0.203: IC1.RG1 34.63,15.59 GAIN1.2
N$7
  Top 0.203: IC1.RG1_1 35.28,15.59 GAIN1.1
N$8
  Top 0.203: IC1.RG2 34.63,22.39 GAIN2.2
N$9
  Top 0.203: IC1.RG2_1 35.28,22.39 GAIN2.1
N$10
  Top 0.203: GAIN3.2 34.79,5.71 IC2.RG1
N$11
  Top 0.203: GAIN3.1 35.44,5.71 IC2.RG1_1
N$12
  Top 0.203: 34.9,11.7 34.9,11.58 IC2.RG2 34.79,13.41 GAIN4.2
N$13
  Top 0.203: GAIN4.1 35.44,13.41 IC2.RG2_1
N$14
  Top 0.203: DC_OFFSET1.1 31.24,18.54 IC1.OUT1
N$15
  Top 0.203: DC_OFFSET2.1 31.19,19.19 IC1.OUT2
N$16
  Top 0.203: IC2.OUT2 31.68,9.86 DC_OFFSET4.1
N$17
  Top 0.203: IC2.OUT1 31.73,9.21 DC_OFFSET3.1
N$18
  Top 0.203: U$8.5 33.05,5.26 C_TANT_4.2
N$19
  Top 0.203: C_TANT_4.1 39.6,3.49 U$9.1
N$21
  Top 0.203: U$18.1 13.35,2.58 15.14,4.37 C_TANT_2.1 15.14,4.46 20.28,4.46 U$10.5
N$28
  Top 0.203: U$7.1 66.74,17.18 IN_CHOOSE9.1
N$34
  Top 0.203: 8.41,4.49 LED.2 8.51,4.49 R_LED.1
NEG_STIM1  (via drill 0.38)
  Top 0.203: U$5.5 47.3,16.64 v47.26,16.64 | U$1.P0_6 14.47,8.06 15.32,8.06 v15.59,7.79
  Bottom 0.203: v47.26,16.64 41.48,16.64 41.48,4.07 19.43,4.07 v15.59,7.79
NEG_STIM2  (via drill 0.38)
  Top 0.203: U$5.14 44.77,19.18 44.74,19.18 44.74,19.16 v44.72,19.16 | U$1.P0_2 14.44,10.15 14.55,10.04 v17.45,10.04
  Bottom 0.203: v44.72,19.16 44.72,17.7 40.38,17.7 40.38,5.1 21.95,5.1 v17.45,10.04
NEG_STIM3  (via drill 0.38)
  Top 0.203: U$6.5 v47.36,5.02 v47.35,5.02 | U$1.P1_2 12.65,5.05 v12.25,4.48
  Bottom 0.203: v12.25,4.48 12.24,2.87 12.62,2.48 24.92,2.48 25,2.48 25.96,2.48 25.97,2.48 26.04,2.47 44.68,2.47 47.23,5.02 v47.35,5.02
NEG_STIM4  (via drill 0.38)
  Top 0.203: U$6.14 44.84,11.55 v44.47,10.16 | U$1.P1_1 13.16,4.38 v12.93,3.62
  Bottom 0.203: v44.47,10.16 44.47,4 43.33,2.86 14.11,2.9 v12.93,3.62
P2_1
  Top 0.203: U$1.P2_1 7.93,9.63 7.44,9.13 7.44,8.16 6.15,6.87 5.76,6.87 5.49,6.59 U$17.5
P2_2  (via drill 0.38 pad 0.64)
  Top 0.203: v6.74,8.45 6.74,9.01 7.86,10.13 U$1.P2_2 | v3.82,5.94 3.98,6.09 U$17.6
  Bottom 0.203: v3.82,5.94 4.22,5.94 v6.74,8.45
P2_3/X32K_Q2
  Top 0.203: U$1.P2_3/XOSC32K_Q2 7.65,10.64 6.93,9.92 32KHZ.Q2 5.84,9.54 C_32KHZ_2.1
P2_4/X32K_Q1
  Top 0.203: U$1.P2_4/XOSC32K_Q1 6.59,11.15 32KHZ.Q1 5.86,11.52 C_32KHZ_1.1
POS_STIM1  (via drill 0.38)
  Top 0.203: U$5.15 43.49,19.12 v43.44,19.12 | U$1.P0_0 15.82,11.15 v16.59,11.54
  Bottom 0.203: v43.44,19.12 43.44,18.12 39.84,18.12 39.84,5.65 26.07,5.65 26.05,5.67 22.77,5.67 16.77,11.67 v16.59,11.54
POS_STIM2  (via drill 0.38)
  Top 0.203: U$5.6 48.5,15.14 v48.5,16.64 | 14.45,9.1 U$1.P0_4 16.12,9.12 v16.36,8.88
  Bottom 0.203: v48.5,16.64 48.5,17.3 40.94,17.3 40.94,4.56 20.82,4.56 v16.36,8.88
POS_STIM3  (via drill 0.38)
  Top 0.203: U$6.15 v43.55,10.14 | U$1.P1_0 14.43,7.1 14.5,7.1 16.26,5.31 v16.33,5.31
  Bottom 0.203: v43.55,10.14 43.55,4.51 42.41,3.37 18.31,3.37 v16.33,5.31
POS_STIM4  (via drill 0.38)
  Top 0.203: U$6.6 48.63,4.96 v48.59,4.96 | U$1.P1_3 12.14,5.46 v11.25,4.67 | v46.3,2.54 17.1,2.54 v16.39,1.84
  Bottom 0.203: v11.25,4.67 11.25,2.24 11.76,1.84 v16.39,1.84 16.57,1.84 | v48.59,4.96 48.59,4.83 v46.3,2.54
RBIAS
  Top 0.203: U$1.RBIAS 8.08,12.42 R_BIAS.1
RESET  (via drill 0.38 pad 0.64)
  Top 0.203: 15.19,12.42 v15.29,12.42 14.53,11.66 U$1.RESET_N | v3.65,13.36 1.84,13.36 1.84,11.76 3.12,11.76 3.12,7.59 U$17.3
  Bottom 0.203: v15.29,12.42 15.29,12.74 15.2,12.83 4.18,12.83 3.65,13.35 v3.65,13.36
RF_N
  Top 0.203: U$2.BALANCED3
  Top 0.254: U$1.RF_N 11.13,13.09 10.62,13.6 U$2.BALANCED3
RF_P
  Top 0.203: U$2.BALANCED4
  Top 0.254: U$1.RF_P 11.63,13.06 12.17,13.59 U$2.BALANCED4
STIM1  (via drill 0.38)
  Top 0.203: U$5.2 U$5.3 44.77,13.25 v45.86,13.26 | v54.86,13.16 55.83,13.16 57.13,11.86 68.88,11.86 68.88,7.03 U$28.1
  Bottom 0.203: v45.86,13.26 54.8,13.22 v54.86,13.16
STIM2  (via drill 0.38)
  Top 0.203: U$5.12 U$5.11 48.59,20.34 v48.58,19.15 | v53.08,18.69 53.74,18.69 53.74,11.22 63.15,11.22 v63.13,11.21 | v63.15,6.81 63.86,7.52 U$28.2
  Bottom 0.203: v48.58,19.15 53.07,19.15 v53.08,18.69 | v63.13,11.21 63.15,10.4 v63.15,6.81
STIM3  (via drill 0.38)
  Top 0.203: U$6.2 U$6.3 45.44,5.73 45.44,4.98 46.25,4.98 47.04,4.19 49,4.19 v49.85,5.05 | v59.17,8.96 65.22,8.94 66.17,7.98 67.36,7.98 U$28.3
  Bottom 0.203: v49.85,5.05 50.12,5.05 53.49,8.41 58.37,8.41 v59.17,8.96
STIM4
  Top 0.203: U$6.12 U$6.11 48.59,11.59 48.59,13.56 52.93,13.56 52.91,10.54 67.38,10.54 U$28.4
SWITCH_OUT
  Top 0.203: 5.18,2.55 U$18.2 5.21,2.75 FILTER_CHIP.1
V+
  Top 0.203: C_TANT_1.1 20.34,10.92 | 20.34,10.92 V+_IN.4 V+_IN.3 | V+_IN.3 V+_IN.2 V+_IN.1 21.18,9.19 | V+_IN.3 21.18,10.16 WIRE+.1 24.7,10.16 25.47,9.38 25.47,6.82 25.87,6.82 25.87,5.11 C_TANT_3.2 27.62,3.36 U$8.3 29.64,3.36 29.93,3.65 29.93,4.86 29.58,5.21 28.95,5.21 U$8.1 | U$10.1 20.52,8.94 20.52,10.28 20.34,10.12 20.34,10.64 | 20.34,10.92 20.34,10.64 | U$10.3 18.36,9.26 19.66,10.56 20.26,10.56 20.34,10.64
VDD  (via drill 0.38 pad 0.64)
  Top 0.203: U$1.AVDD2 U$1.AVDD1 U$1.AVDD4 9.6,13.03 C_271.2 C_272.2 8.11,13.37 v7.81,13.67 | C311.2 | U$1.AVDD3 12.14,12.96 13.87,14.69 C_241.1 14.45,14.69 v14.67,14.91 | U$1.AVDD5 13.67,12.75 14.09,13.17 17.42,13.17 | U$1.AVDD6 7.81,11.66 v7.37,12.1 6.86,12.61 C_101.2 | v6.04,6.05 5.14,5.16 4.12,5.16 3.56,4.61 C_CHIP_RES.1 2.59,3.09 FILTER_CHIP.2 | C311.2 U$1.DVDD2 | 17.42,13.17 v17.42,12.39 | 17.42,13.17 C_211.1 | U$17.1 4.88,9.34 v4.94,9.4 | C311.2 14.41,5.38 v14.62,5.6 | C_391.1 6.98,6.62 6.79,6.81 v6.04,6.05 | v6.04,6.05 v6.04,6.07 7.55,7.58 8.32,7.58 U$1.DVDD1
  Bottom 0.203: v6.04,6.05 7.81,7.83 7.81,9.4 | 7.81,9.4 7.81,11.66 v7.37,12.1 | v7.37,12.1 7.66,12.38 14.57,12.38 14.57,10.73 | v7.81,13.67 7.41,14.07 2.75,14.07 2.75,13.27 3.71,12.31 7.16,12.31 v7.37,12.1 | 7.17,12.3 v7.37,12.1 | 16.43,12.58 16.43,13.14 v14.67,14.91 | 16.43,12.58 14.57,10.73 | 16.43,12.58 17.42,12.58 v17.42,12.39 17.42,12.28 | v4.94,9.4 7.81,9.4 | 14.57,10.73 14.57,5.65 v14.62,5.6
VDD2  (via drill 0.38)
  Top 0.203: DC1.2 DC.2 26.4,17.11 v26.4,15.06 26.4,9.87 27.55,8.71 DC4.2 DC6.2 | IC1.VS 33.01,17.58 v32.21,16.78 | IC1.VS_B 37.72,17.89 v37.9,17.71 37.93,17.74 37.93,18.46 40.85,21.38 41.09,21.38 42.13,20.34 U$5.16 | 37.66,8.64 37.78,8.64 38.37,9.22 38.37,11.43 37.68,12.12 37.68,12.71 38.2,13.23 39.51,13.23 39.87,12.87 U$9.2 42.14,11.69 U$6.16 42.28,10.35 43.07,9.57 43.07,8.87 | 37.66,8.64 37.15,8.64 IC2.VS_B | IC2.VS 33.17,8.48 v31.88,7.55 | 37.66,8.64 37.85,8.45 v37.85,7.84 41.87,7.84 42.34,7.37 42.34,6.41 U$6.1 | 43.07,8.87 43.07,8.07 42.33,7.33 42.33,6.19 42.28,6.14 42.28,6.01 | U$6.10 49.9,10.26 v49.21,9.57 | v45.3,8.89 43.09,8.89 43.07,8.87 | U$5.16 42.23,21.25 v42.82,21.84 | v49.53,21.97 49.53,20.65 U$5.10 | U$4.8 58.68,4.47 v59.96,5.75 | U$5.1 U$5.16
  Bottom 0.203: v32.21,16.78 32.21,15.96 30.69,14.43 27.03,14.43 v26.4,15.06 | v37.9,17.71 33.14,17.71 v32.21,16.78 | 33.11,7.64 33.23,7.76 | 33.23,7.76 34.12,8.65 37.04,8.65 v37.85,7.84 | v45.3,8.89 45.98,9.57 v49.21,9.57 49.61,9.97 59.67,9.97 59.96,9.68 v59.96,5.75 | v42.82,21.84 49.4,21.84 v49.53,21.97 | v32.21,16.78 31.93,16.79 v31.88,7.55 33.23,7.76
VEE  (via drill 0.38)
  Top 0.203: IC1.-VS 32.19,19.84 v32.19,20.38 | IC1.-VS_B 38,19.84 v38,20.18 38.95,20.18 38.95,22.9 46.03,22.9 U$5.13 46.03,18.43 | IC2.-VS_B 37.66,10.51 v37.66,11.22 | v32.63,11.43 32.63,10.51 IC2.-VS | U$5.9 51.12,18.43 46.03,18.43 | U$6.4 46.09,8.78 | 46.09,8.78 U$6.13 46.03,11.61 46.8,12.37 46.8,13.93 46.03,14.7 U$5.4 46.03,18.43 | U$6.9 51.17,9.28 | 51.17,9.28 51.17,8.78 46.09,8.78 | U$4.5 55.8,4.12 C_NEG1.2 54.07,5.07 52.25,6.89 52.25,8.2 51.17,9.28
  Bottom 0.203: v32.19,20.38 38,20.38 v38,20.18 39.37,20.18 39.37,11.22 v37.66,11.22 32.63,11.22 v32.63,11.43
X32M_Q1
  Top 0.203: U$1.XOSC_Q1 13.16,12.82 13.98,13.64 C_32MHZ_1.1 18.63,15.64 U$3.Q1
X32M_Q2
  Top 0.203: U$1.XOSC_Q2 12.65,12.88 13.92,14.15 15.86,14.15 C_32MHZ_2.1 U$3.Q2

### Text on the board
tValues: Gain1 | Zigbee + EMG + Stimulation / Kevin Keller / iBionics Lab NCSU Dec 2015 | EMG1 | EMG1 | Stim2 | AD8222 | EMG2 | EMG4 | Stim Switch | EMG3 | Balun | EMG2 | DC Offset / V divider | Gain2 | Stim1 | EMG electrode Inputs / 0 resistors needed to / select either ground / or electrode | DC Offset / V divider | Stim4 | EMG4 | Gain4 | AD8222 | Stim4 | Stim Switch | Stim3 | Stim2 | EMG3 | V inverter | Stim1 | Gain3 | Stim3 | Stimulation Outputs